# EasyEDA Pro project Rainbow.eprj

# Schematic Schematic1
Board Name: Board1; Create Date: 2022-11-18; Page Name: P1; Project Name: Rainbow; Schematic Name: Schematic1; Update Date: 2024-11-10; Company: 嘉立创EDA; Page Size: A4; Version: V1.0
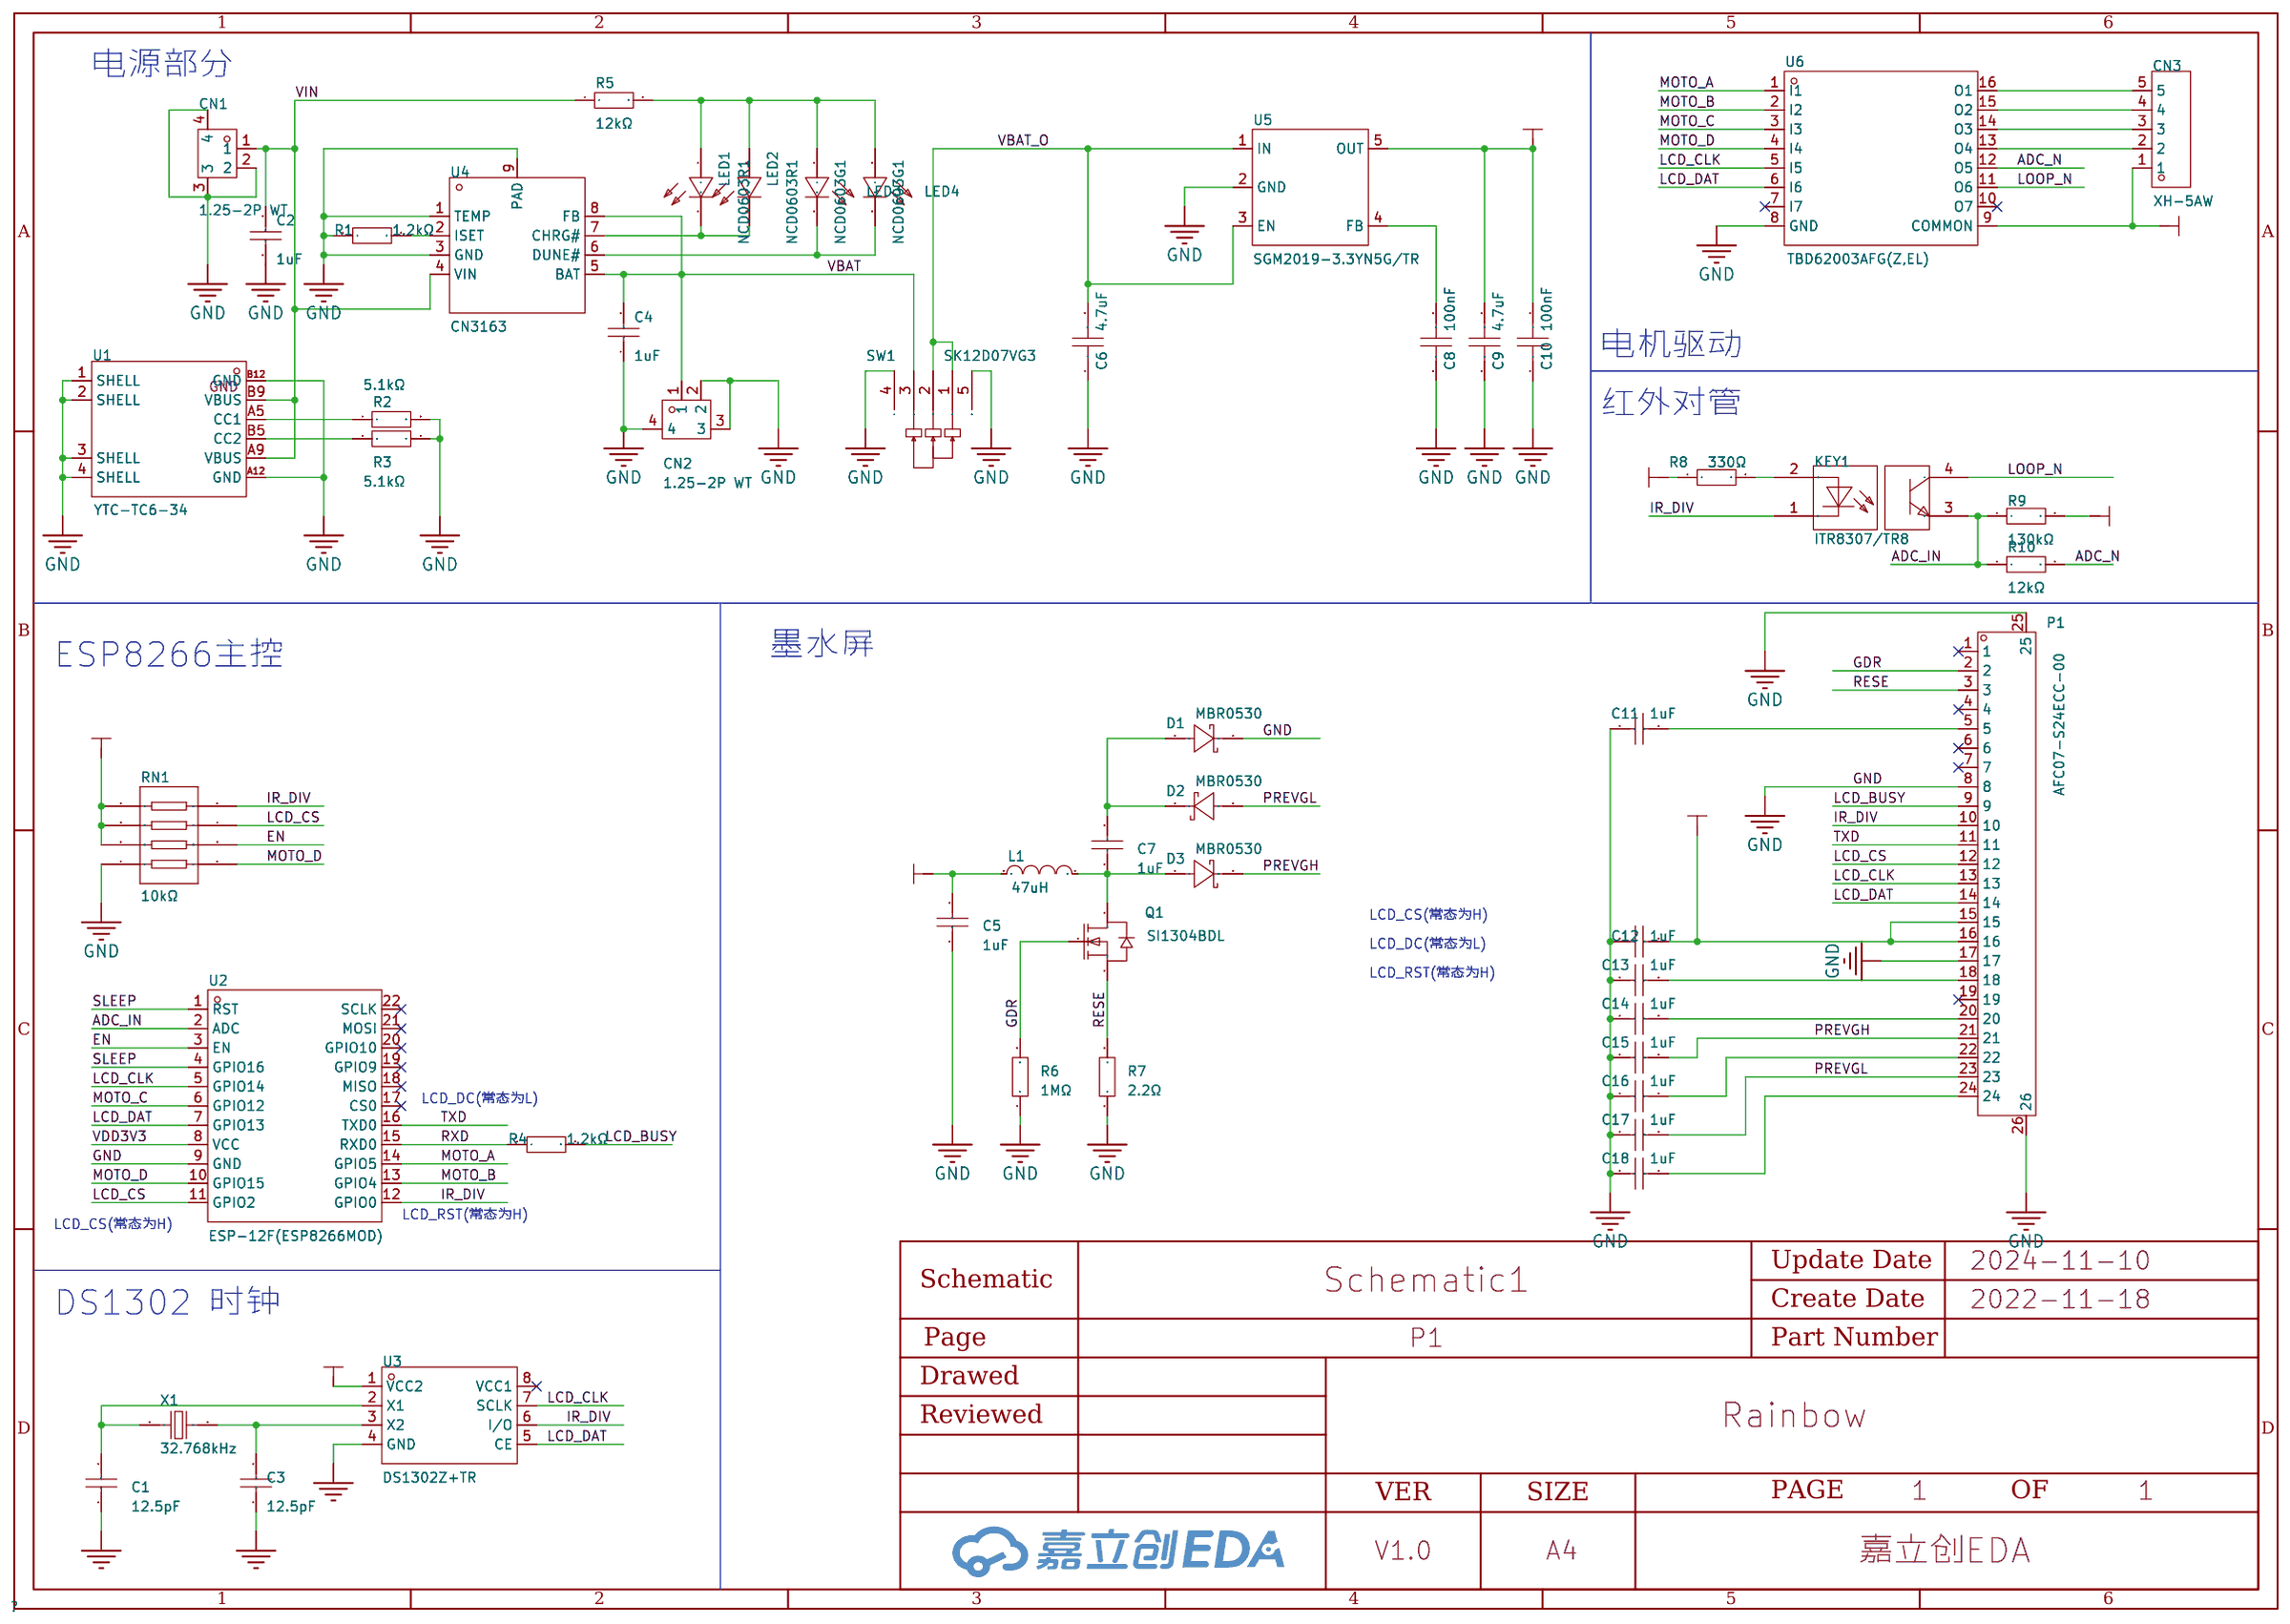
[diagram p0: schematic sheet]

## Parts
C1  12.5pF  [C0603]
C2  1uF  [C0603]
C3  12.5pF  [C0603]
C4  1uF  [C0603]
C5  1uF  [C0603]
C6  4.7uF  [C0603]
C7  1uF  [C0603]
C8  100nF  [C0603]
C9  4.7uF  [C0603]
C10  100nF  [C0603]
C11  1uF  [C0603]
C12  1uF  [C0603]
C13  1uF  [C0603]
C14  1uF  [C0603]
C15  1uF  [C0603]
C16  1uF  [C0603]
C17  1uF  [C0603]
C18  1uF  [C0603]
CN1  1.25-2P WT  [CONN-SMD_1.25-2PWT]
CN2  1.25-2P WT  [CONN-SMD_1.25-2PWT]
CN3  XH-5AW  [CONN-TH_5P-P2.54_XH-5AW_C2908614]
D1  MBR0530  [SOD-123_L2.7-W1.6-LS3.7-RD-1]
D2  MBR0530  [SOD-123_L2.7-W1.6-LS3.7-RD-1]
D3  MBR0530  [SOD-123_L2.7-W1.6-LS3.7-RD-1]
KEY1  ITR8307/TR8  [OPTO-4P-L3.4-W2.7-P1.30-LS4.6]
L1  47uH  [IND-SMD_L5.0-W5.0_MPIT50X0]
LED1  NCD0603R1  [LED0603-RD_RED]
LED2  NCD0603R1  [LED0603-RD_RED]
LED3  NCD0603G1  [LED0603-RD]
LED4  NCD0603G1  [LED0603-RD]
P1  AFC07-S24ECC-00  [FPC-SMD_24P-L17.5-W5.4-P0.50]
Q1  SI1304BDL  [SC-70-3_L2.1-W1.3-P1.30-LS2.1-TL]
R1  1.2kΩ  [R0603]
R2  5.1kΩ  [R0603]
R3  5.1kΩ  [R0603]
R4  1.2kΩ  [R0603]
R5  12kΩ  [R0603]
R6  1MΩ  [R0603]
R7  2.2Ω  [R0603]
R8  330Ω  [R0603]
R9  130kΩ  [R0603]
R10  12kΩ  [R0603]
RN1  10kΩ  [RES-ARRAY-SMD_0603-8P-L3.2-W1.6-BL]
SW1  SK12D07VG3  [SW-TH_SK12D07VG3]
U1  YTC-TC6-34  [USB-C-SMD_YIYUAN_YTC-TC6-33]
U2  ESP-12F(ESP8266MOD)  [WIFIM-SMD_ESP-12F-ESP8266MOD]
U3  DS1302Z+TR  [SOIC-8_L4.9-W3.9-P1.27-LS6.0-BL]
U4  CN3163  [ESOP-8_L4.9-W3.9-P1.27-LS6.0-BL-EP]
U5  SGM2019-3.3YN5G/TR  [SOT-23-5_L3.0-W1.7-P0.95-LS2.8-BR]
U6  TBD62003AFG(Z,EL)  [SOIC-16_L10.8-W4.5-P1.27-LS6.8-BL]
X1  32.768kHz  [CRYSTAL-SMD_L7.0-W3.2-LS7.5]

## Library data of the parts
C1 C3 = CC0603JRNPO9BN200: 容值:20pF;精度:±5%;额定电压:50V;材质(温度系数):NP0;; LCSC Part Name: 20pF ±5% 50V; Supplier Part: C105621; Manufacturer: YAGEO(国巨); Supplier Footprint: 0603; JLCPCB Part Class: Extended Part; Datasheet: https://atta.szlcsc.com/upload/public/pdf/source/20170425/1493115771885.pdf; Supplier: LCSC; Tolerance: ±5%; Voltage Rated: 50V; Temperature Coefficient: NP0
C2 C4 C5 C7 C11-C18 = CL10A105KB8NNNC: 温度系数:X5R;精度:±10%;额定电压:50V;容值:1uF;; LCSC Part Name: 1uF(105) ±10% 50V; Supplier Part: C15849; Manufacturer: SAMSUNG(三星); Supplier Footprint: 0603; JLCPCB Part Class: Basic Part; Datasheet: https://atta.szlcsc.com/upload/public/pdf/source/20160103/1457707679084.pdf; Supplier: LCSC; Temperature Coefficient: X5R; Tolerance: ±10%; Voltage Rated: 50V
C6 C9 = CL10A106KP8NNNC: 容值:10uF;精度:±10%;额定电压:10V;材质(温度系数):X5R;; LCSC Part Name: 10uF ±10% 10V; Supplier Part: C19702; Manufacturer: SAMSUNG(三星); Supplier Footprint: 0603; JLCPCB Part Class: Basic Part; Datasheet: https://atta.szlcsc.com/upload/public/pdf/source/20160103/1457707703378.pdf; Supplier: LCSC; Tolerance: ±10%; Voltage Rated: 10V; Temperature Coefficient: X5R
C8 C10 = CC0603KRX7R9BB104: 容值:100nF;精度:±10%;额定电压:50V;材质(温度系数):X7R;; LCSC Part Name: 100nF ±10% 50V; Supplier Part: C14663; Manufacturer: YAGEO(国巨); Supplier Footprint: 0603; JLCPCB Part Class: Basic Part; Datasheet: https://atta.szlcsc.com/upload/public/pdf/source/20170116/1484561234239.pdf; Supplier: LCSC; Tolerance: ±10%; Voltage Rated: 50V; Temperature Coefficient: X7R
CN1 CN2 = 1.25-2P WT: 参考系列:-;间距:1.25mm;插针结构:1x2P;排数:1;每排PIN数:2;行距:-;公母:公型插针;安装方式:卧贴;额定电流:1A;工作温度范围:-25~+85;; LCSC Part Name: 1.25卧贴针座 1.25mm间距2P卧式贴片 WT指的是卧贴; Supplier Part: C668614; Manufacturer: SHOU HAN(首韩); Supplier Footprint: SMD,P=1.25mm; JLCPCB Part Class: Extended Part; Datasheet: https://atta.szlcsc.com/upload/public/pdf/source/20200618/C668614_A66416DD0743C4A51377B45DB73E146E.pdf; Supplier: LCSC; Pitch: 1.25mm; Pins Structure: 1x2P; Number of Rows: 1; Number of PINs Per Row: 2; Gender: 公型插针; Mounting Style: 卧贴; Current Rating (Max): 1A; Operating Temperature Range: -25~+85
CN3 = XH-5AW: 参考系列:XH;间距:2.54mm;插针结构:1x5P;排数:1;每排PIN数:5;行距:-;公母:公型插针;安装方式:弯插;额定电流:3A;工作温度范围:-25~+85;; LCSC Part Name: 5P 2.54mm; Supplier Part: C2908614; Manufacturer: HCTL(华灿天禄); Supplier Footprint: 插件,P=2.54mm; JLCPCB Part Class: Extended Part; Datasheet: https://atta.szlcsc.com/upload/public/pdf/source/20211021/ACA2D54D99493880102FCACAC8DAABA8.pdf; Supplier: LCSC; Reference Series: XH; Pitch: 2.54mm; Pins Structure: 1x5P; Number of Rows: 1; Number of PINs Per Row: 5; Gender: 公型插针; Mounting Style: 弯插; Current Rating (Max): 3A; Operating Temperature Range: -25~+85
D1-D3 = MBR0530_C699108: 直流反向耐压(Vr):30V;平均整流电流(Io):500mA;正向压降(Vf):550mV@500mA;; LCSC Part Name: 30V 500mA 550mV@500mA; Supplier Part: C699108; Manufacturer: YANGJIE(扬杰); Supplier Footprint: SOD-123; JLCPCB Part Class: Extended Part; Datasheet: https://atta.szlcsc.com/upload/public/pdf/source/20200709/C699108_94C8F1A54679DD603C9696C8694A3BC2.pdf; Supplier: LCSC; Reverse Voltage (Vr): 30V; Average Rectified Current (Io): 500mA; Forward Voltage (Vf@If): 550mV@500mA
KEY1 = ITR8307/TR8: Supplier Part: C67922; Manufacturer: EVERLIGHT(台湾亿光); Supplier Footprint: SMD; JLCPCB Part Class: Extended Part; Datasheet: https://atta.szlcsc.com/upload/public/pdf/source/20171026/C67922_15089856553751059593.pdf; Supplier: LCSC
L1 = MPIT5020-470M-LF: 电感值:47uH;精度:±20%;额定电流:-;直流电阻(DCR):-;; LCSC Part Name: 47uH ±20%; Supplier Part: C696476; Manufacturer: microgate(麦捷科技); Supplier Footprint: SMD; JLCPCB Part Class: Extended Part; Datasheet: https://atta.szlcsc.com/upload/public/pdf/source/20200707/C696475_E9BDF73C854779A782235EC557F5C3FA.pdf; Supplier: LCSC; Tolerance: ±20%
LED1 LED2 = NCD0603R1_C84263: 发光颜色:红灯;; LCSC Part Name: 红灯; Supplier Part: C84263; Manufacturer: 国星光电; Supplier Footprint: 0603; JLCPCB Part Class: Extended Part; Datasheet: https://atta.szlcsc.com/upload/public/pdf/source/20200820/C84263_DABC6A75E58F576973B407FDBA283D60.pdf; Supplier: LCSC; Emitted Color: 红灯
LED3 LED4 = NCD0603G1: 发光颜色:翠绿;; LCSC Part Name: 翠绿; Supplier Part: C84267; Manufacturer: 国星光电; Supplier Footprint: 0603; JLCPCB Part Class: Extended Part; Datasheet: https://atta.szlcsc.com/upload/public/pdf/source/20200820/C84267_04BA7703640BAC111D09F5EFB971FBF3.pdf; Supplier: LCSC; Emitted Color: 翠绿
P1 = AFC07-S24ECC-00: 间距:0.5mm;触点数量:24;锁定特性:抽屉式;安装类型:卧贴;触点类型:上接;; LCSC Part Name: 0.5mm P数:24 抽屉式 上接; Supplier Part: C11092; Manufacturer: JS(钜硕电子); Supplier Footprint: SMD,P=0.5mm; JLCPCB Part Class: Extended Part; Datasheet: https://atta.szlcsc.com/upload/public/pdf/source/20151024/1457707484416.pdf; Supplier: LCSC; Pitch: 0.5mm; Number of Contacts: 24; Locking Feature: 抽屉式; Mounting Type: 卧贴; Contact Type: 上接; Height Above Board: 2mm; FFC, FCB Thickness: 0.3mm
Q1 = SI1304BDL: 类型:N沟道;漏源电压(Vdss):20V;连续漏极电流(Id):4A;功率(Pd):-;导通电阻(RDS(on)@Vgs,Id):36mΩ@10V,4A;阈值电压(Vgs(th)@Id):-;栅极电荷(Qg@Vgs):-;输入电容(Ciss@Vds):-;反向传输电容(Crss@Vds):-;; LCSC Part Name: N沟道 20V 4A; Supplier Part: C710060; Manufacturer: VBsemi(微碧); Supplier Footprint: SC-70-3; JLCPCB Part Class: Extended Part; Datasheet: https://atta.szlcsc.com/upload/public/pdf/source/20200723/C710060_EBAE81AD5E022006CACE43A153102A3D.pdf; Supplier: LCSC; Type: N沟道; Drain Source Voltage (Vdss): 20V; Continuous Drain Current (Id): 4A; Drain Source On Resistance (RDS(on)@Vgs,Id): 36mΩ@10V,4A
R1 R4 = RC0603FR-071K2L: 电阻类型:厚膜电阻;阻值:1.2kΩ;精度:±1%;功率:100mW;温度系数:±100ppm/;最大工作电压:75V;工作温度范围:-55~+155;; LCSC Part Name: 1.2kΩ ±1% 100mW; Supplier Part: C114605; Manufacturer: YAGEO(国巨); Supplier Footprint: 0603; JLCPCB Part Class: Extended Part; Datasheet: https://atta.szlcsc.com/upload/public/pdf/source/20170912/C114605_1505207784050963429.pdf; Supplier: LCSC; Type: 厚膜电阻; Tolerance: ±1%; Power(Watts): 100mW; Temperature Coefficient: ±100ppm/; Overload Voltage (Max): 75V; Operating Temperature Range: -55~+155
R2 R3 R5 R10 = RC0603FR-0712KL: 电阻类型:厚膜电阻;阻值:12kΩ;精度:±1%;功率:100mW;温度系数:±100ppm/;最大工作电压:75V;工作温度范围:-55~+155;; LCSC Part Name: 12kΩ ±1%; Supplier Part: C114659; Manufacturer: YAGEO(国巨); Supplier Footprint: 0603; JLCPCB Part Class: Extended Part; Datasheet: https://atta.szlcsc.com/upload/public/pdf/source/20170818/C114659_1503051151743895126.pdf; Supplier: LCSC; Type: 厚膜电阻; Tolerance: ±1%; Power(Watts): 100mW; Temperature Coefficient: ±100ppm/; Overload Voltage (Max): 75V; Operating Temperature Range: -55~+155
R6 = RC0603FR-071ML: 电阻类型:厚膜电阻;阻值:1MΩ;精度:±1%;功率:100mW;温度系数:±100ppm/;最大工作电压:75V;工作温度范围:-55~+155;; LCSC Part Name: 1MΩ ±1% 100mW; Supplier Part: C105578; Manufacturer: YAGEO(国巨); Supplier Footprint: 0603; JLCPCB Part Class: Extended Part; Datasheet: https://atta.szlcsc.com/upload/public/pdf/source/20181102/C105578_67A9388250AF143DE4682E62257D2969.pdf; Supplier: LCSC; Type: 厚膜电阻; Tolerance: ±1%; Power(Watts): 100mW; Temperature Coefficient: ±100ppm/; Overload Voltage (Max): 75V; Operating Temperature Range: -55~+155
R7 = RC0603FR-072R2L: 电阻类型:厚膜电阻;阻值:2.2Ω;精度:±1%;功率:100mW;温度系数:±200ppm/;最大工作电压:75V;工作温度范围:-55~+155;; LCSC Part Name: 2.2Ω ±1% 100mW; Supplier Part: C112307; Manufacturer: YAGEO(国巨); Supplier Footprint: 0603; JLCPCB Part Class: Extended Part; Datasheet: https://atta.szlcsc.com/upload/public/pdf/source/20170912/C112307_1505207748319963378.pdf; Supplier: LCSC; Type: 厚膜电阻; Tolerance: ±1%; Power(Watts): 100mW; Temperature Coefficient: ±200ppm/; Overload Voltage (Max): 75V; Operating Temperature Range: -55~+155
R8 = RC0603FR-07330RL: 电阻类型:厚膜电阻;阻值:330Ω;精度:±1%;功率:100mW;温度系数:±100ppm/;最大工作电压:75V;工作温度范围:-55~+155;; LCSC Part Name: 330Ω ±1% 100mW; Supplier Part: C105881; Manufacturer: YAGEO(国巨); Supplier Footprint: 0603; JLCPCB Part Class: Extended Part; Datasheet: https://atta.szlcsc.com/upload/public/pdf/source/20170818/C105881_1503051103301895052.pdf; Supplier: LCSC; Type: 厚膜电阻; Tolerance: ±1%; Power(Watts): 100mW; Temperature Coefficient: ±100ppm/; Overload Voltage (Max): 75V; Operating Temperature Range: -55~+155
R9 = RC0603FR-07130KL: 电阻类型:厚膜电阻;阻值:130kΩ;精度:±1%;功率:100mW;; LCSC Part Name: 130kΩ ±1% 100mW; Supplier Part: C163432; Manufacturer: YAGEO(国巨); Supplier Footprint: 0603; JLCPCB Part Class: Extended Part; Datasheet: https://atta.szlcsc.com/upload/public/pdf/source/20180111/C163432_15156544276051258953.pdf; Supplier: LCSC; Type: 厚膜电阻; Tolerance: ±1%; Power(Watts): 100mW; Temperature Coefficient: ±100ppm/℃; Overload Voltage (Max): 75V; Operating Temperature Range: -55℃~+155℃
RN1 = 4D03WGJ0103T5E: 阻值:10kΩ;单个元件功率:62.5mW;电阻器数:4;引脚数:8;; LCSC Part Name: 10kΩ ±5%; Supplier Part: C29718; Manufacturer: UNI-ROYAL(厚声); Supplier Footprint: 0603x4; JLCPCB Part Class: Basic Part; Datasheet: https://atta.szlcsc.com/upload/public/pdf/source/20170615/1497511005633.pdf; Supplier: LCSC; Power(Watts): 62.5mW; Number of Resistors: 4; Number of Pins: 8
SW1 = SK12D07VG3: LCSC Part Name: 两档位卧式拨动开关,柄长3MM; Supplier Part: C431547; Manufacturer: SHOU HAN(首韩); Supplier Footprint: 插件; JLCPCB Part Class: Extended Part; Datasheet: https://atta.szlcsc.com/upload/public/pdf/source/20190925/C431547_01B93C6F3FA5C09E15F8CCBF4E6DB91A.pdf; Supplier: LCSC
U1 = YTC-TC6-34: 连接器类型:Type-C;标准:-;公母:母座;触点数量:6;端口数量:1;安装方式:沉板;额定电流 - 电源:5A;工作温度范围:-20℃~+85℃;; LCSC Part Name: Type-C 母座 沉板; Supplier Part: C2927284; Manufacturer: YIYUAN(怡远); Supplier Footprint: SMD; JLCPCB Part Class: Extended Part; Datasheet: https://atta.szlcsc.com/upload/public/pdf/source/20211202/C52547D62212D3B747C05A2501E14934.pdf; Supplier: LCSC; Connector Type: Type-C; Gender: 母座; Number of Contacts: 6; Number of Ports: 1; Mounting Style: 沉板; Current Rating - Power (Max): 5A; Operating Temperature Range: -20℃~+85℃; NO_CONNECT: yes; NAME: GND
U2 = ESP-12F(ESP8266MOD): 屏蔽罩上的丝印是：ESP8266MOD，ESP8266EX串口WIFI; Supplier Part: C82891; Manufacturer: Ai-Thinker(安信可); Supplier Footprint: WIFI模块; JLCPCB Part Class: Extended Part; Datasheet: https://atta.szlcsc.com/upload/public/pdf/source/20181205/C82891_2E0132AC394619135072CDB340405D53.pdf; Supplier: LCSC
U3 = DS1302Z+T&R: 接口:SPI;; Supplier Part: C8959; Manufacturer: ADI(亚德诺)/MAXIM(美信); Supplier Footprint: SOIC-8; JLCPCB Part Class: 扩展库; Datasheet: https://atta.szlcsc.com/upload/public/pdf/source/20120901/1457706533203.pdf; Supplier: LCSC; Interface: SPI; Operating Voltage: 2V~5.5V
U4 = CN3163: 充电电池的类型:-;电池单元组数:-;最大充电电流:-;充满的电池组电压:-;最大供应电压:-;; Supplier Part: C559031; Manufacturer: CONSONANCE(上海如韵); Supplier Footprint: ESOP-8; JLCPCB Part Class: Extended Part; Datasheet: https://atta.szlcsc.com/upload/public/pdf/source/20200525/C559031_07C3DFF767A107D34DBB0F6756A9105C.pdf; Supplier: LCSC
U5 = SGM2019-3.3YN5G/TR: 输出类型:固定;输出极性:正;输出通道数:1;最大输入电压:5.5V;输出电压:3.3V;压差:400mV@(300mA);输出电流:300mA;电源纹波抑制比(PSRR):74dB@(1kHz);; LCSC Part Name: 正 Vin=5.5V Vout=3.3V 300mA 74dB@(1kHz); Supplier Part: C23613; Manufacturer: SGMICRO(圣邦微); Supplier Footprint: SOT-23-5; JLCPCB Part Class: Extended Part; Datasheet: https://atta.szlcsc.com/upload/public/pdf/source/20140228/1457706997483.pdf; Supplier: LCSC; Output Type: 固定; Output Polarity: 正; Number of Outputs: 1; Maximum Input Voltage: 5.5V; Output Voltage: 3.3V; Dropout Voltage: 400mV@(300mA); Output Current: 300mA; Power Supply Rejection Ratio (PSRR): 74dB@(1kHz)
U6 = TBD62003AFG(Z,EL): 新产品，本芯片用场效应管作输出管，相比传统的ULN2003（三极管做输出管）管压降更低，芯片发热更少，驱动性能更佳。; Supplier Part: C163227; Manufacturer: TOSHIBA(东芝); Supplier Footprint: SOIC-16; JLCPCB Part Class: Extended Part; Datasheet: https://atta.szlcsc.com/upload/public/pdf/source/20180126/C163227_15169515295441308285.pdf; Supplier: LCSC
X1 = HY32768KSMD3068YA2R30: 频率:32.768kHz;常温频差:±20ppm;外接负载电容:12.5pF;频率稳定度(全温):±10ppm;; LCSC Part Name: 32.768kHz ±20ppm 12.5pF; Supplier Part: C5265854; Manufacturer: Huiyuan crystal(惠源晶工); Supplier Footprint: HC-49S-SMD-Mini; JLCPCB Part Class: 扩展库; Datasheet: https://atta.szlcsc.com/upload/public/pdf/source/20221116/C6A24499FD916DB4626B9C4DB8881109.pdf; Supplier: LCSC; Normal temperature Frequency Tolerance: ±20ppm; External load capacitor: 12.5pF; Frequency Stability(Full temperature range): ±10ppm; Equivalent Series Resistance (ESR): 70kΩ; Operating Temperature: -20℃~+70℃

## Nets
GND: C1.1 C2.1 C3.1 C4.1 C5.1 C6.1 C8.1 C9.1 C10.1 C11.1 C12.1 C13.1 C14.1 C15.1 C16.1 C17.1 C18.1 CN1.2 CN1.3 CN1.4 CN2.2 CN2.3 CN2.4 D1.1(K) P1.8 P1.17 P1.25 P1.26 R1.1 R2.2 R3.2 R6.1 R7.1 RN1.4 SW1.4 SW1.5 U1.1(SHELL) U1.2(SHELL) U1.3(SHELL) U1.4(SHELL) U1.A12(GND) U1.B12(GND) U2.9(GND) U3.4(GND) U4.1(TEMP) U4.3(GND) U4.9(PAD) U5.2(GND) U6.8(GND)
VBAT: C4.2 CN2.1 SW1.3 U4.5(BAT) U4.8(FB)
VBAT_O: C6.2 CN3.1 R9.2 SW1.1 SW1.2 U5.1(IN) U5.3(EN) U6.9(COMMON)
VDD3V3: C5.2 C9.2 C10.2 C12.2 L1.1 P1.15 P1.16 R8.1 RN1.1 RN1.2 RN1.3 U2.8(VCC) U3.1(VCC2) U5.5(OUT)
VIN: C2.2 CN1.1 R5.1 U1.A9(VBUS) U1.B9(VBUS) U4.4(VIN)
ADC_IN: KEY1.3 R9.1 R10.1 U2.2(ADC)
ADC_N: R10.2 U6.12(O5)
EN: RN1.6 U2.3(EN)
GDR: P1.2 Q1.1(G) R6.2
IR_DIV: KEY1.1 P1.10 RN1.8 U2.12(GPIO0) U3.6(I/O)
LCD_BUSY: P1.9 R4.2
LCD_CLK: P1.13 U2.5(GPIO14) U3.7(SCLK) U6.5(I5)
LCD_CS: P1.12 RN1.7 U2.11(GPIO2)
LCD_DAT: P1.14 U2.7(GPIO13) U3.5(CE) U6.6(I6)
LOOP_N: KEY1.4 U6.11(O6)
MOTO_A: U2.14(GPIO5) U6.1(I1)
MOTO_B: U2.13(GPIO4) U6.2(I2)
MOTO_C: U2.6(GPIO12) U6.3(I3)
MOTO_D: RN1.5 U2.10(GPIO15) U6.4(I4)
PREVGH: C15.2 D3.1(K) P1.21
PREVGL: C17.2 D2.2(A) P1.23
RESE: P1.3 Q1.2(S) R7.2
RXD: R4.1 U2.15(RXD0)
SLEEP: U2.1(RST) U2.4(GPIO16)
TXD: P1.11 U2.16(TXD0)
$1N3873: C8.2 U5.4(FB)
$1N4113: LED1.1(K) LED2.1(K) U4.7(CHRG#)
$1N4121: LED3.1(K) LED4.1(K) U4.6(DUNE#)
$1N5064: LED1.2(A) LED2.2(A) LED3.2(A) LED4.2(A) R5.2
$1N5356: R1.2 U4.2(ISET)
$1N10896: KEY1.2 R8.2
$1N16714: C14.2 P1.20
$1N16794: C16.2 P1.22
$1N16876: C18.2 P1.24
$1N17283: C13.2 P1.18
$1N19263: C11.2 P1.5
$1N20556: C7.2 D1.2(A) D2.1(K)
$1N20618: C7.1 D3.2(A) L1.2 Q1.3(D)
$1N39288: CN3.5 U6.16(O1)
$1N39568: CN3.4 U6.15(O2)
$1N39637: CN3.3 U6.14(O3)
$1N39740: CN3.2 U6.13(O4)
$1N63361: R3.1 U1.B5(CC2)
$1N63365: R2.1 U1.A5(CC1)
$1N63715: C1.2 U3.2(X1) X1.1
$1N63722: C3.2 U3.3(X2) X1.2

Not connected (* = marked no-connect by the designer): P1 1* 4* 6* 7* 19*; U2 17(CS0)* 18(MISO)* 19(GPIO9)* 20(GPIO10)* 21(MOSI)* 22(SCLK)*; U3 8(VCC1)*; U6 7(I7)* 10(O7)*

## Notes on the sheet
- 电源部分
- 电机驱动
- 红外对管
- 墨水屏
- ESP8266主控
- LCD_CS(常态为H)
- LCD_DC(常态为L)
- LCD_RST(常态为H)
- LCD_DC(常态为L)
- LCD_CS(常态为H)
- LCD_RST(常态为H)
- DS1302 时钟

# Board PCB1
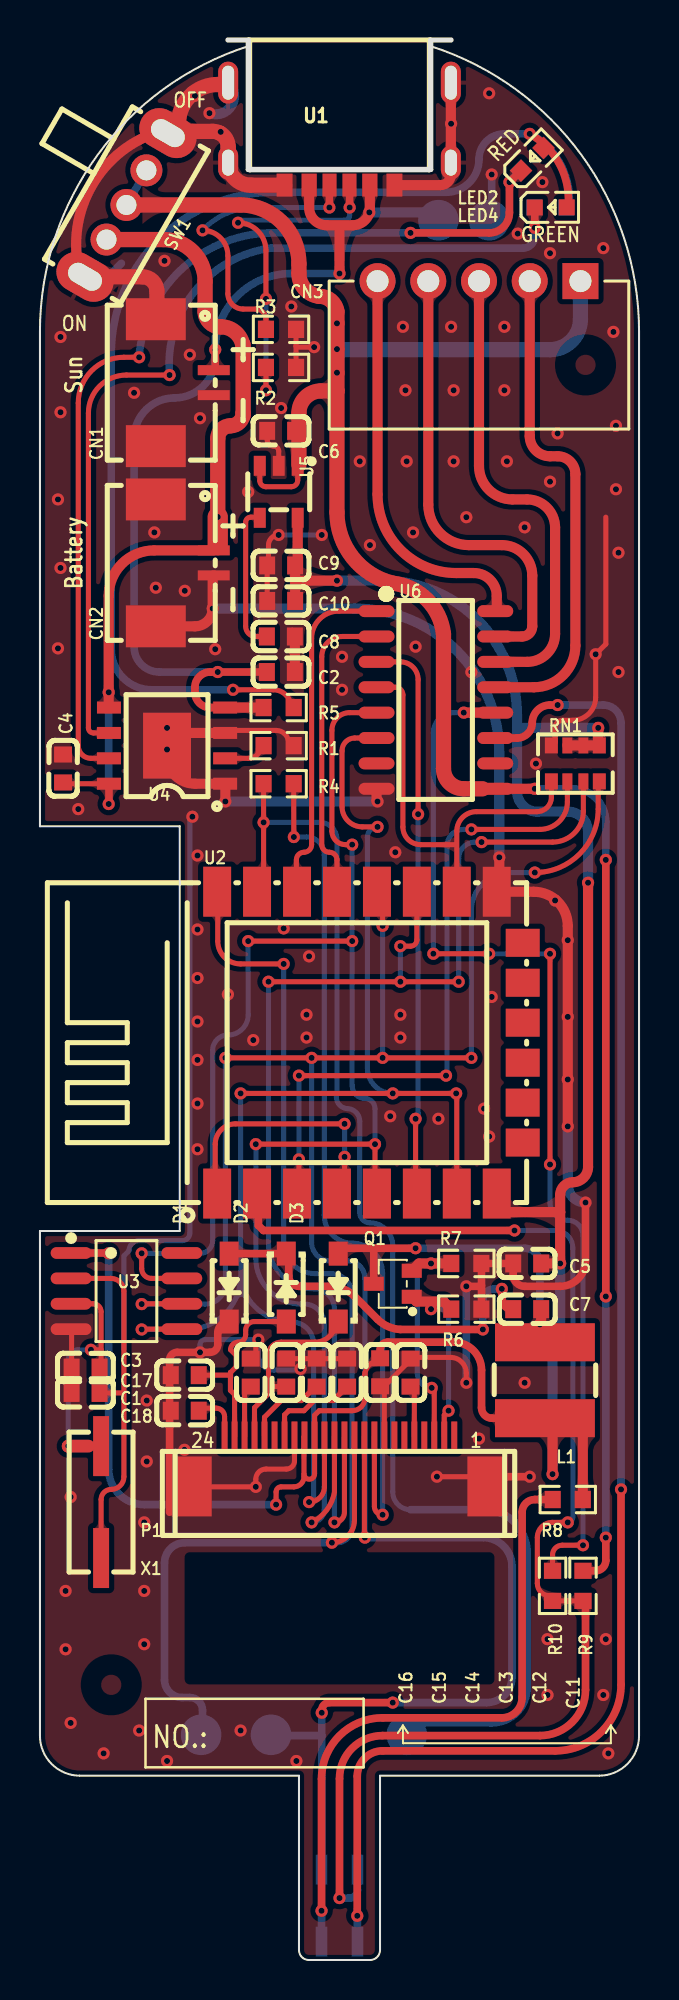
[diagram p1: board, top side]
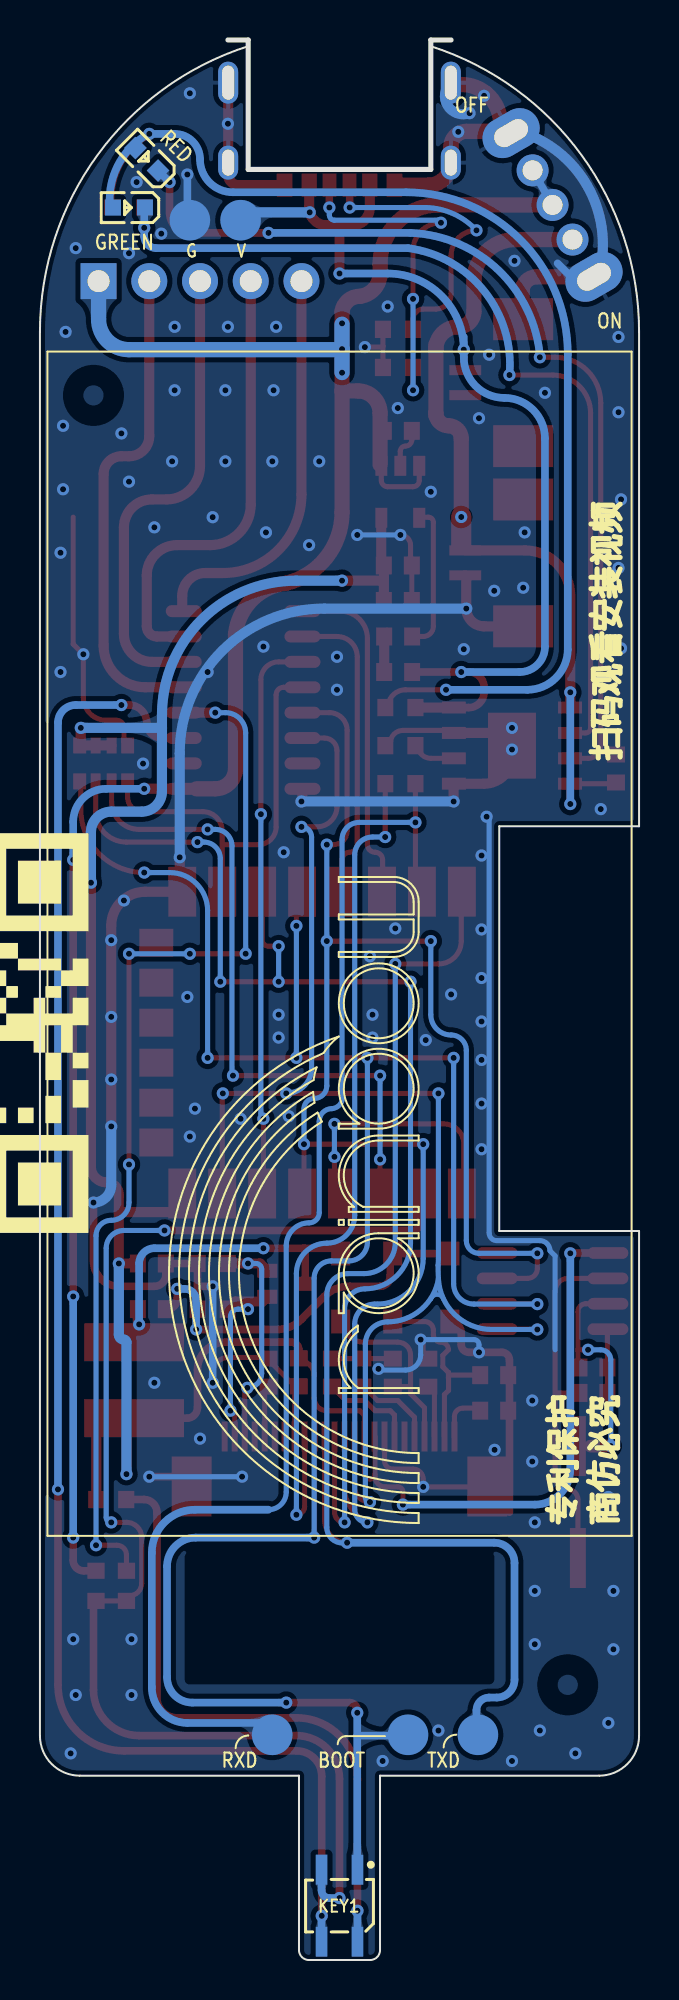
[diagram p2: board, bottom side, seen from below]

Outline 30 x 96.06 mm; copper layers: Top Layer, Bottom Layer. Coordinates in mm from the lower left corner of the outline.
Outline path: 19.57,95.75 arc(27.12,90.31) 30,81.47 30,11.22 arc(29.41,9.81) 28,9.22 17.03,9.22 17.03,0.5 arc(16.88,0.15) 16.53,0 13.47,0 arc(13.12,0.15) 12.97,0.5 12.97,9.22 2,9.22 arc(0.59,9.81) 0,11.22 0,36.47 7,36.47 7,56.72 0,56.72 0,81.47 arc(2.88,90.31) 10.43,95.75 10.43,89.61 19.57,89.61
Stack: Top Layer 0.035mm / Dielectric1 1.51mm FR4 er 4.5 / Bottom Layer 0.035mm

## Design rules (mm)
template: 用户自定义配置
spacing safeClearance (default): track to track 0.152, other pairs 0.152 to 0.3
track width trackWidth (default): min 0.127, default 0.254, max 2.54
differential pair differentialPair (default): width min 0.127, default 0.254, max 2.54; gap min 0.152, default 0.152
via viaSize (default): diameter min 0.5, default 0.61, max 10; hole min 0.3, default 0.305, max 6

## Placement (name value [footprint] x y rotation side)
C1  12.5pF  [C0603]  2.29 28.37 0 top
C2  1uF  [C0603]  12.06 64.44 180 top
C3  12.5pF  [C0603]  2.29 29.64 0 top
C4  1uF  [C0603]  1.16 59.62 270 top
C5  1uF  [C0603]  24.4 34.85 0 top
C6  4.7uF  [C0603]  12.08 76.51 0 top
C7  1uF  [C0603]  24.4 32.56 180 top
C8  100nF  [C0603]  12.06 66.22 180 top
C9  4.7uF  [C0603]  12.08 69.78 0 top
C10  100nF  [C0603]  12.08 68 0 top
C11  1uF  [C0603]  18.56 29.39 270 top
C12  1uF  [C0603]  17.04 29.4 90 top
C13  1uF  [C0603]  15.38 29.39 270 top
C14  1uF  [C0603]  13.86 29.39 270 top
C15  1uF  [C0603]  12.33 29.39 270 top
C16  1uF  [C0603]  10.56 29.39 270 top
C17  1uF  [C0603]  7.25 29.26 0 top
C18  1uF  [C0603]  7.25 27.48 0 top
CN1  1.25-2P WT  [CONN-SMD_1.25-2PWT]  7.25 78.92 90 top
CN2  1.25-2P WT  [CONN-SMD_1.25-2PWT]  7.25 69.9 90 top
CN3  XH-5AW  [CONN-TH_5P-P2.54_XH-5AW_C2908614]  21.99 84 180 top
D1  MBR0530  [SOD-123_L2.7-W1.6-LS3.7-RD-1]  9.48 33.64 90 top
D2  MBR0530  [SOD-123_L2.7-W1.6-LS3.7-RD-1]  12.33 33.64 270 top
D3  MBR0530  [SOD-123_L2.7-W1.6-LS3.7-RD-1]  14.94 33.64 90 top
KEY1  ITR8307/TR8  [OPTO-4P-L3.4-W2.7-P1.30-LS4.6]  15 2.72 90 bottom
L1  47uH  [IND-SMD_L5.0-W5.0_MPIT50X0]  25.29 29.01 90 top
LED1  NCD0603R1  [LED0603-RD_RED]  24.65 90.1 45 bottom
LED2  NCD0603R1  [LED0603-RD_RED]  24.65 90.1 45 top
LED3  NCD0603G1  [LED0603-RD]  25.54 87.68 0 bottom
LED4  NCD0603G1  [LED0603-RD]  25.58 87.69 0 top
NOREF  -  [Pad_e3813]  19.95 87.05 0 top
NOREF#2  -  [Pad_e1130]  18.37 11.27 180 top
NOREF#3  -  [Pad_e1124]  8.07 11.27 0 top
NOREF#4  -  [Pad_e1129]  11.57 11.27 0 top
NOREF#5  -  [Pad_e3814]  22.49 87.05 0 top
P1  AFC07-S24ECC-00  [FPC-SMD_24P-L17.5-W5.4-P0.50]  15 24.94 0 top
Q1  SI1304BDL  [SC-70-3_L2.1-W1.3-P1.30-LS2.1-TL]  17.67 33.83 180 top
R1  1.2kΩ  [R0603]  11.95 60.76 180 top
R2  5.1kΩ  [R0603]  12.07 79.68 0 top
R3  5.1kΩ  [R0603]  12.07 81.59 0 top
R4  1.2kΩ  [R0603]  11.95 58.85 0 top
R5  12kΩ  [R0603]  11.95 62.66 0 top
R6  1MΩ  [R0603]  21.35 32.56 180 top
R7  2.2Ω  [R0603]  21.35 34.85 180 top
R8  330Ω  [R0603]  26.43 23.04 180 top
R9  130kΩ  [R0603]  27.19 18.72 90 top
R10  12kΩ  [R0603]  25.67 18.72 90 top
RN1  10kΩ  [RES-ARRAY-SMD_0603-8P-L3.2-W1.6-BL]  26.81 59.87 180 top
SW1  SK12D07VG3  [SW-TH_SK12D07VG3]  4.33 87.81 240 top
U1  YTC-TC6-34  [USB-C-SMD_YIYUAN_YTC-TC6-33]  15 91.37 180 top
U2  ESP-12F(ESP8266MOD)  [WIFIM-SMD_ESP-12F-ESP8266MOD]  16.52 45.9 0 top
U3  DS1302Z+TR  [SOIC-8_L4.9-W3.9-P1.27-LS6.0-BL]  4.33 33.47 270 top
U4  CN3163  [ESOP-8_L4.9-W3.9-P1.27-LS6.0-BL-EP]  6.36 60.76 90 top
U5  SGM2019-3.3YN5G/TR  [SOT-23-5_L3.0-W1.7-P0.95-LS2.8-BR]  11.96 73.46 90 top
U6  TBD62003AFG(Z,EL)  [SOIC-16_L10.8-W4.5-P1.27-LS6.8-BL]  19.83 63.04 270 top
X1  32.768kHz  [CRYSTAL-SMD_L7.0-W3.2-LS7.5]  3.06 22.91 90 top

## Footprints (pads in the part's own frame, mm; a bottom-side part is the same pattern mirrored in y, then rotated)
C0603
  rect 0.8x0.9 smd: 1(-0.7,0) 2(0.7,0)
CONN-SMD_1.25-2PWT
  rect 0.5x1.6 smd: 1(0.625,-1.45) 2(-0.625,-1.45)
  rect 2.1x2.999 smd: 3(3.175,1.45) 4(-3.175,1.45)
CONN-TH_5P-P2.54_XH-5AW_C2908614
  rect 1.801x1.801 hole 1.1: 1(-5.08,0)
  round 1.801 hole 1.1: 2(-2.54,0) 3(0,0) 4(2.54,0) 5(5.08,0)
CRYSTAL-SMD_L7.0-W3.2-LS7.5
  rect 3x0.8 smd: 1(-2.8,0) 2(2.8,0)
ESOP-8_L4.9-W3.9-P1.27-LS6.0-BL-EP
  rect 0.6x1.2 smd: 1(-1.905,-2.909) 2(-0.635,-2.909) 3(0.635,-2.909) 4(1.905,-2.909) 5(1.905,2.909) 6(0.635,2.909) 7(-0.635,2.909) 8(-1.905,2.909)
  rect 3.3x2.4 smd: 9(0,0)
FPC-SMD_24P-L17.5-W5.4-P0.50
  rect 0.299x1.501 smd: 1(5.745,1.25) 2(5.245,1.25) 3(4.745,1.25) 4(4.245,1.25) 5(3.747,1.25) 6(3.246,1.25) 7(2.745,1.25) 8(2.245,1.25) 9(1.745,1.25) 10(1.244,1.25) 11(0.747,1.25) 12(0.246,1.25) 13(-0.254,1.25) 14(-0.754,1.25) 15(-1.25,1.25) 16(-1.755,1.25) 17(-2.256,1.25) 18(-2.753,1.25) 19(-3.253,1.25) 20(-3.756,1.25) 21(-4.257,1.25) 22(-4.755,1.25) 23(-5.255,1.25) 24(-5.755,1.25)
  rect 1.999x2.999 smd: 25(-7.402,-1.25) 26(7.402,-1.25)
IND-SMD_L5.0-W5.0_MPIT50X0
  rect 1.9x5 smd: 1(-1.9,0) 2(1.9,0)
LED0603-RD
  rect 0.8x0.8 smd: 1(-0.799,-0.004) 2(0.799,0.004)
LED0603-RD_RED
  rect 0.8x0.8 smd: 1(-0.799,-0.004) 2(0.799,0.004)
OPTO-4P-L3.4-W2.7-P1.30-LS4.6
  rect 1.501x0.579 smd: 1(1.801,-0.899) 2(-1.801,-0.899) 3(1.801,0.899) 4(-1.801,0.899)
Pad_e1124
  round 2.032 smd far side: 1(0,0)
Pad_e1129
  round 2.032 smd far side: 2(0,0)
Pad_e1130
  round 2.032 smd far side: 3(0,0)
Pad_e3813
  round 2.032 smd far side: 1(0,0)
Pad_e3814
  round 2.032 smd far side: 1(0,0)
R0603
  rect 0.806x0.864 smd: 1(-0.753,0) 2(0.753,0)
RES-ARRAY-SMD_0603-8P-L3.2-W1.6-BL
  rect 0.65x0.8 smd: 1(-1.2,-0.9) 4(1.2,-0.9) 5(1.2,0.9) 8(-1.2,0.9)
  rect 0.5x0.8 smd: 2(-0.4,-0.9) 3(0.4,-0.9) 6(0.4,0.9) 7(-0.4,0.9)
SC-70-3_L2.1-W1.3-P1.30-LS2.1-TL
  rect 1.001x0.701 smd: 1(-0.95,0.65) 2(-0.95,-0.65) 3(0.95,0)
SOD-123_L2.7-W1.6-LS3.7-RD-1
  rect 1.2x0.95 smd: 1(-1.7,0) 2(1.7,0)
SOIC-8_L4.9-W3.9-P1.27-LS6.0-BL
  oval 0.588x2.045 smd: 1(-1.905,-2.772) 2(-0.635,-2.772) 3(0.635,-2.772) 4(1.905,-2.772) 5(1.905,2.772) 6(0.635,2.772) 7(-0.635,2.772) 8(-1.905,2.772)
SOIC-16_L10.8-W4.5-P1.27-LS6.8-BL
  oval 0.6x1.801 smd: 1(-4.445,-2.972) 2(-3.175,-2.972) 3(-1.905,-2.972) 4(-0.635,-2.972) 5(0.635,-2.972) 6(1.905,-2.972) 7(3.175,-2.972) 8(4.445,-2.972) 9(4.445,2.972) 10(3.175,2.972) 11(1.905,2.972) 12(0.635,2.972) 13(-0.635,2.972) 14(-1.905,2.972) 15(-3.175,2.972) 16(-4.445,2.972)
SOT-23-5_L3.0-W1.7-P0.95-LS2.8-BR
  rect 1x0.6 smd: 1(1.3,-0.95) 2(1.3,0) 3(1.3,0.95) 4(-1.3,0.95) 5(-1.3,-0.95)
SW-TH_SK12D07VG3
  oval 1.6x1.6 hole 1.001: 1(-1.999,0) 2(0,0) 3(1.999,0)
  oval 1.999x2.999 hole 1.001x1.801: 4(4.151,0) 5(-4.151,0)
USB-C-SMD_YIYUAN_YTC-TC6-33
  oval 1x1.7 hole 0.6x1.3: 1(-5.575,1.438) 2(5.575,1.438)
  oval 1x2.1 hole 0.6x1.7: 3(-5.575,-2.562) 4(5.575,-2.562)
  rect 0.7x1.15 smd: A5(-0.5,2.562) B5(0.5,2.562)
  rect 0.76x1.15 smd: A9(1.52,2.562) B9(-1.52,2.562)
  rect 0.8x1.15 smd: A12(2.75,2.562) B12(-2.75,2.562)
WIFIM-SMD_ESP-12F-ESP8266MOD
  rect 1.399x2.499 smd: 1(-7.651,-7.551) 2(-5.652,-7.551) 3(-3.65,-7.551) 4(-1.651,-7.551) 5(0.35,-7.551) 6(2.349,-7.551) 7(4.348,-7.551) 8(6.35,-7.551) 9(6.35,7.549) 10(4.348,7.551) 11(2.349,7.551) 12(0.35,7.551) 13(-1.651,7.549) 14(-3.65,7.551) 15(-5.652,7.551) 16(-7.651,7.551)
  rect 1.7x1.399 smd: 17(7.651,-4.998) 18(7.648,-3.002) 19(7.651,-1.004) 20(7.651,0.998) 21(7.651,2.997) 22(7.651,4.996)

## Nets
As in the schematic, except:
GND: C1.1 C2.1 C3.1 C4.1 C5.1 C6.1 C8.1 C9.1 C10.1 C11.1 C12.1 C13.1 C14.1 C15.1 C16.1 C17.1 C18.1 CN1.2 CN1.3 CN1.4 CN2.2 CN2.3 CN2.4 D1.1 NOREF#5.1 P1.8 P1.17 P1.25 P1.26 R1.1 R2.2 R3.2 R6.1 R7.1 RN1.4 SW1.4 SW1.5 U1.1 U1.2 U1.3 U1.4 U1.A12 U1.B12 U2.9 U3.4 U4.1 U4.3 U4.9 U5.2 U6.8
VIN: C2.2 CN1.1 NOREF.1 R5.1 U1.A9 U1.B9 U4.4
IR_DIV: KEY1.1 NOREF#4.2 P1.10 RN1.8 U2.12 U3.6
RXD: NOREF#2.3 R4.1 U2.15
TXD: NOREF#3.1 P1.11 U2.16

Pads without a net: P1 1 4 6 7 19; U2 17 18 19 20 21 22; U3 8; U6 7 10

## Via types
v1: diameter 0.61, hole 0.305, Top Layer to Bottom Layer, 220 vias

## Routing (per net, layer and track width the routed paths; a pad name or vN(x,y) marks a point on that pad's centre or on a via; arc(x,y) is an arc through that point)
GND: length 241.6
  Top Layer w0.254: 12.64,66.54 12.64,66.09 ; 17.24,28.7 17.25,28.69 17.25,26.19 ; 17.24,28.7 C12.1 ; 17.24,28.7 18.68,30.15 20.56,30.15 arc(21.12,29.92) 21.35,29.36 v1(21.35,28.88) ; C13.1 C14.1 C15.1 ; v1(10.94,31.04) 10.81,30.91 10.81,30.09 ; 12.71,60.89 R1.1 ; 9.27,61.52 11.83,61.52 arc(12.27,61.34) 12.45,60.89 ; 1.59,31.55 C3.1 C1.1 ; U5.2 11.96,75.49 arc(11.88,75.67) 11.7,75.74 arc(11.47,75.84) 11.38,76.06 C6.1 ; P1.17 12.75,24.98 arc(12.63,24.68) 12.33,24.56 11.32,24.56 arc(10.96,24.41) 10.81,24.06 v1(10.81,23.67) 7.62,23.67 P1.25 ; RN1.4 25.8,60.95 25.8,61.65 arc(25.91,61.92) 26.18,62.03 26.68,62.03 arc(27.49,62.36) 27.83,63.17 v1(27.83,65.33) 28.34,65.84 28.34,72.19 ; 21.91,24.18 v1(19.88,24.18) ; C10.1 C9.1 11.44,69.84 11.44,70.79 arc(11.59,71.15) v1(11.95,71.3) ; 12.82,80.74 R2.2 ; 12.82,80.74 R3.2 ; 12.82,80.74 arc(12.84,80.71) 12.87,80.7 v1(13.73,80.7)
  Top Layer w0.381: v1(21.35,33.71) 22.09,33.71 arc(22.11,33.71) 22.11,33.73 ; R6.1 22.11,32.57 22.11,34.84 R7.1 C5.1 23.7,34.28 arc(23.87,33.87) 24.27,33.71 26.05,33.71 arc(26.95,34.08) 27.32,34.98 v1(27.32,37.9) ; 22.76,24.18 v1(24.53,24.18) ; 6.49,22.4 6.49,30.02 arc(6.6,30.29) 6.87,30.41 v1(8.02,30.41) 8.52,30.41 arc(8.79,30.52) 8.9,30.79 8.9,31.37 arc(9.07,31.78) D1.1
  Top Layer w0.508: 2,84.34 arc(2.6,88.79) 6.15,91.53 ; U2.9 24.73,53.45 arc(25.93,52.95) 26.43,51.74 v1(26.43,51.03) v1(26.43,47.19) v1(26.43,44.06) v1(26.43,41.71) ; U2.9 22.75,53.45 ; U2.9 arc(22.96,53.49) 23,53.58 v1(23,55.17) ; C8.1 C2.1 ; 20.58,93.93 20.58,89.32 arc(20.42,88.95) 20.06,88.8 U1.B12 ; 9.28,58.85 v1(9.28,57.96) ; 16.85,58.6 16.85,58.02 v1(16.91,57.96) ; U4.3 7,61.39 U4.9 6.36,60.25 arc(6.77,59.26) 7.76,58.85 U4.1 ; CN2.4 7.76,66.73 arc(8.39,66.99) v1(8.65,67.62) 8.65,69.22 CN2.2
  Top Layer w0.762: 9.44,93.84 8.9,93.84 arc(8.24,93.72) 7.66,93.39 arc(7.13,92.72) 6.94,91.88 ; 7.47,91.49 8.65,91.49 arc(8.84,91.47) 9.02,91.4 arc(9.31,91.12) 9.43,90.72 U1.2 arc(9.75,89.13) 10.55,88.8 U1.A12 ; SW1.4 5.13,84.21 arc(5.64,84) 5.86,83.49 5.86,82.15 arc(5.84,82.11) CN1.3
  Bottom Layer w0.254: v1(14.11,71.3) v1(11.95,71.3) ; v1(8.02,30.41) 8.02,30.79 arc(8.09,30.97) 8.27,31.04 v1(10.94,31.04) 10.94,30.28 arc(11.16,29.74) 11.7,29.52 12.99,29.52 arc(13.03,29.53) v1(13.05,29.58) ; v1(19.88,24.18) v1(24.53,24.18) ; 4.21,30.53 4.21,35.23 4.46,35.49 arc(4.61,35.84) 4.97,35.99 7.13,35.99 arc(7.4,36.1) 7.51,36.37 7.51,57.08 arc(7.54,57.16) v1(7.63,57.2)
  Bottom Layer w0.381: v1(21.35,33.71) v1(21.35,28.88) ; v1(22.62,89.33) 22.62,87.17 ; SW1.4 3.4,84.21 4.08,84.89
  Bottom Layer w0.508: 2,84.34 arc(2.6,88.79) 6.15,91.53 ; v1(26.43,41.71) 26.43,38.79 arc(26.69,38.16) v1(27.32,37.9) ; v1(9.28,57.96) v1(16.91,57.96) ; v1(23,55.17) 23,60.38 arc(20.88,65.5) 15.76,67.62 v1(8.65,67.62) ; v1(8.49,92.4) arc(9.59,92.78) U1.4
  vias: v1(0.9,73.08) v1(0.9,65.63) v1(1.03,81.21) v1(1.03,77.44) v1(1.03,69.65) v1(1.28,18.47) v1(1.28,15.55) v1(1.54,23.17) v1(1.54,11.86) v1(1.92,57.58) v1(3.19,10.34) v1(4.71,78.41) v1(4.97,11.48) v1(5.22,21.9) v1(5.22,18.47) v1(5.22,15.8) v1(5.35,27.99) v1(5.35,24.94) v1(5.73,71.43) v1(5.8,68.66) v1(6.24,85.02) v1(6.36,61.65) v1(6.36,60.56) v1(6.36,9.96) v1(7.25,68.51) v1(7.24,25.53) v1(7.51,80.32) v1(7.76,93.27) v1(7.89,55.26) v1(7.89,51.56) v1(7.89,49.13) v1(7.89,46.96) v1(7.89,45.03) v1(7.89,42.85) v1(7.89,40.57) v1(8.02,77.14) v1(8.78,65.58) v1(9.05,91.47) v1(9.41,48.31) v1(10.05,11.48) v1(10.43,73.46) v1(10.68,46.03) v1(12.08,77.65) v1(12.21,51.61) v1(12.59,82.73) v1(12.84,9.96) v1(13.35,47.3) v1(13.35,46.15) v1(13.48,50.22) v1(15.13,65.2) v1(15.13,63.55) v1(16.02,74.98) v1(16.52,70.79) v1(17.54,42.22) v1(17.79,55.42) v1(18.05,47.3) v1(18.05,46.15) v1(18.18,81.71) v1(18.3,78.54) v1(18.36,74.98) v1(18.68,71.43) v1(18.81,65.71) v1(19.95,42.09) v1(20.59,91.87) v1(20.59,81.71) v1(20.72,78.54) v1(20.72,74.98) v1(21.35,72.19) v1(21.6,64.44) v1(21.99,26.09) v1(22.24,42.6) v1(22.49,93.4) v1(22.49,41.2) v1(22.62,48.19) v1(23.25,81.71) v1(23.25,78.54) v1(23.38,74.98) v1(23.92,86.37) v1(24.27,71.68) v1(24.27,28.88) v1(24.84,59.86) v1(25.16,88.95) v1(25.41,16.05) v1(25.41,13.26) v1(25.54,85.4) v1(25.54,73.97) v1(25.8,53.01) v1(25.92,76.38) v1(28.21,85.65) v1(28.21,13.26) v1(28.34,16.05) v1(28.46,10.34) v1(28.72,81.46) v1(28.84,76.76) v1(28.84,73.59) v1(28.97,70.41) v1(28.97,64.44)
VBAT: length 42.6
  Top Layer w0.254: C4.2 1.22,58.85 U4.8
  Top Layer w0.381: v1(3.44,57.84) 3.46,57.85 U4.8
  Top Layer w0.508: U4.5 3.44,62.68 v1(3.44,63.43) 3.44,68.25 arc(4.11,69.86) 5.72,70.53 CN2.1
  Top Layer w0.762: SW1.3 6.19,86.08 arc(7.66,85.47) 8.27,84 8.27,82.48 arc(8.49,81.94) 9.03,81.71 9.06,81.71 arc(9.85,81.39) 10.17,80.6 ; 10.17,80.6 10.17,80.82 ; 10.17,80.6 10.17,77.4 ; 10.17,77.27 10.17,77.4 ; 10.17,77.4 arc(9.99,76.95) 9.54,76.76 arc(9.09,76.57) 8.9,76.13 v1(8.9,72.2)
  Top Layer w1.016: v1(8.9,72.2) 8.9,70.79
  Bottom Layer w0.381: v1(3.44,63.43) v1(3.44,57.84)
VBAT_O: length 114.9
  Top Layer w0.254: U5.3 11.01,74.02 arc(11.1,73.8) 11.32,73.71 12.59,73.71 arc(12.81,73.81) 12.91,74.03 12.91,74.76
  Top Layer w0.381: v1(28.34,33.2) v1(28.34,55.04) ; R9.2 27.82,19.47 arc(28.18,19.63) 28.34,19.99 v1(28.34,21.13)
  Top Layer w0.508: v1(24.78,58.6) 22.8,58.6
  Top Layer w0.762: 14.87,78.51 v1(14.87,79.42) v1(14.87,80.6) v1(14.87,81.89) 14.87,82.48 arc(14.57,83.03) 13.98,83.24 arc(13.26,83.62) 12.97,84.38 12.97,84.87 arc(12.11,86.95) 10.03,87.81 SW1.2 ; 14.87,78.51 14.87,72.43 arc(15.66,70.17) 17.67,68.89 arc(19.38,68.06) 20.21,66.35 20.21,59.62 arc(20.5,58.9) 21.22,58.6 22.16,58.6 ; 14.87,78.51 14.08,78.51 arc(13.29,78.18) 12.97,77.4 12.97,74.82
  Bottom Layer w0.381: v1(24.78,58.6) 26.68,58.6 arc(27.85,58.12) 28.34,56.95 v1(28.34,55.04) ; SW1.1 SW1.2 ; v1(28.34,21.13) v1(28.34,33.2)
  Bottom Layer w0.762: 14.87,80.57 v1(14.87,80.6) 14.87,81.84 ; 14.87,80.57 14.87,79.43 ; 14.87,80.57 25.54,80.57 arc(26.62,81.02) 27.06,82.09 27.06,84
VDD3V3: length 126.8
  Top Layer w0.254: 13.22,24.31 arc(13.5,24.05) 13.75,24.33 P1.15 13.75,27.25 13.98,27.48 15.64,27.48 arc(16.08,27.67) 16.27,28.12 16.27,29.26 ; 16.27,29.26 16.27,29.39 ; 16.27,29.26 arc(16.48,29.77) 16.99,29.98 ; 11.83,22.91 11.83,23.42 arc(11.9,23.6) 12.08,23.67 12.71,23.67 arc(13.07,23.82) 13.22,24.18 13.22,26.17 13.25,26.19 ; 16.99,30.1 C12.2
  Top Layer w0.381: L1.1 22.64,27.11 arc(22.27,27.26) 22.11,27.63 22.11,29.52 arc(21.7,30.5) 20.72,30.91 17.41,30.91 arc(17.15,30.8) 17.04,30.54 C12.2 ; U3.1 3.43,35.37 arc(3.45,35.38) v1(3.44,35.36)
  Top Layer w0.508: 12.91,72.16 12.91,70.03 12.78,69.9 12.78,69.14 ; 12.78,69.14 12.91,69.01 v1(14.87,69.01) ; 12.78,69.14 C10.2 ; R8.1 27.18,27.61 ; RN1.3 RN1.2 RN1.1 27.95,60.83 v1(27.95,61.65) ; U2.8 22.87,37.9 23.35,37.42 26.05,37.42 ; C5.2 v1(26.05,34.85) 26.05,37.42 ; 26.05,37.42 26.05,38.28 arc(26.23,38.73) 26.68,38.91 arc(27.22,39.14) 27.45,39.68 v1(27.45,53.9) ; v1(25.67,24.31) 25.67,26.73
  Bottom Layer w0.381: v1(11.83,22.78) 5.22,22.78 arc(3.96,23.31) 3.44,24.56 v1(3.44,35.36)
  Bottom Layer w0.508: v1(27.95,61.65) 23.89,61.65 ; 23.89,61.65 23.89,58.47 arc(24.19,57.75) 24.91,57.46 26.43,57.46 arc(27.15,57.16) 27.45,56.44 v1(27.45,53.9) ; 23.89,61.65 23.89,62.28 arc(21.92,67.04) 17.16,69.01 v1(14.87,69.01) ; v1(25.67,24.31) 25.67,30.91 arc(25.71,31) 25.8,31.04 arc(25.97,31.11) 26.05,31.29 v1(26.05,34.85)
VIN: length 52.1
  Top Layer w0.381: U4.4 8.52,62.66 arc(7.98,62.89) 7.76,63.43 7.76,63.68 arc(7.98,64.22) 8.52,64.44 v1(8.9,64.44) C2.2 ; v1(8.78,80.57) 8.78,79.62 arc(8.76,79.57) CN1.1
  Top Layer w0.508: v1(15,84.38) 15,86.67 ; 11.33,62.54 R5.1 U4.4 ; U1.B9 16.52,87.66 arc(16.27,87.05) 15.66,86.79 14.37,86.79 arc(13.74,87.05) 13.48,87.68 U1.A9
  Bottom Layer w0.381: 8.78,81.21 v1(8.78,80.57) ; v1(8.78,80.57) 8.78,80.19 arc(8.18,78.75) 6.75,78.16 arc(5.31,77.56) 4.71,76.13 4.71,65.71 arc(5.08,64.81) 5.98,64.44 8.78,64.44 ; v1(8.78,80.57) arc(9.89,83.26) 12.59,84.38 v1(15,84.38)
  Bottom Layer w0.508: v1(16.49,87.44) 19.56,87.44
ADC_IN: length 66.1
  Top Layer w0.254: v1(26.43,21.9) 25.66,21.9 arc(25.13,21.68) 24.91,21.14 24.91,18.85 arc(25.09,18.4) 25.53,18.22 ; 25.53,17.97 R10.1 R9.1
  Top Layer w0.381: U2.2 10.94,38.28 10.94,36.76 11.19,36.5 v1(23.76,36.5) ; v1(15,3.1) 15,9.07 arc(15.63,10.6) 17.16,11.23 25.03,11.23 arc(26.65,11.9) 27.32,13.51 27.32,17.71 27.19,17.84
  Bottom Layer w0.254: v1(23.76,36.5) 25.8,36.5 arc(26.42,36.24) 26.68,35.61 26.68,22.15 arc(26.61,21.97) v1(26.43,21.9)
  Bottom Layer w0.381: v1(15,3.1) 15.51,3.1 arc(15.78,3.21) 15.9,3.49 KEY1.3
ADC_N: length 53.7
  Top Layer w0.254: R10.2 25.67,20.27 arc(25.81,20.61) 26.15,20.75 v1(27.19,20.75) ; v1(19.7,50.35) 22.49,50.35 arc(22.49,50.35) v1(22.49,50.34) ; v1(25.54,39.8) v1(25.54,50.34)
  Top Layer w0.508: U6.12 v1(21.22,62.41)
  Bottom Layer w0.254: v1(19.7,50.35) 19.7,61.39 arc(20,62.11) 20.72,62.41 v1(21.22,62.41) ; v1(27.19,20.75) 27.19,36.25 arc(26.97,36.79) 26.43,37.01 arc(25.8,37.27) 25.54,37.9 v1(25.54,39.8) ; v1(25.54,50.34) v1(22.49,50.34)
EN: length 32.9
  Top Layer w0.254: v1(12.97,40.06) 12.97,38.44 U2.3 ; 26.41,58.76 26.41,57.95 arc(26.01,56.97) 25.03,56.57 v1(21.6,56.57) ; v1(20.33,44.25) v1(12.97,44.25)
  Bottom Layer w0.254: v1(12.97,40.06) v1(12.97,44.25) ; v1(20.33,44.25) 20.38,44.3 20.38,55.74 arc(20.63,56.32) 21.22,56.57 v1(21.6,56.57)
GDR: length 9.4
  Top Layer w0.254: P1.2 20.25,27.27 v1(20.46,27.48)
  Top Layer w0.508: R6.2 20.22,32.95 18.86,32.95 Q1.1
  Bottom Layer w0.254: v1(19.58,32.56) 20.08,32.56 arc(20.35,32.45) 20.46,32.18 v1(20.46,27.48)
IR_DIV: length 122.2
  Top Layer w0.254: v1(16.27,21.13) 16.25,21.16 P1.10 ; v1(21.6,45.14) v1(17.16,45.14) v1(13.6,45.14) v1(9.28,45.14) ; U2.12 17.16,53.17 v1(17.16,51.74) ; U3.6 5.21,32.83 ; RN1.8 arc(27.97,58.95) 27.95,58.91 27.95,57.58 arc(27.02,55.34) v1(24.78,54.41)
  Top Layer w0.381: v1(17.67,12.88) 14.49,12.88 arc(14.22,12.77) 14.11,12.5 v1(14.11,12.37)
  Bottom Layer w0.254: v1(9.28,45.14) 9.28,33.83 arc(8.99,33.12) 8.27,32.82 v1(5.09,32.82) ; 21.6,45.26 21.6,52.5 arc(22.16,53.85) 23.51,54.41 v1(24.78,54.41) ; v1(17.16,45.14) v1(17.16,51.74) ; v1(13.6,45.14) 13.6,35.92 arc(13.88,35.25) 14.54,34.98 15.41,34.98 arc(16.02,34.72) 16.27,34.12 v1(16.27,21.13)
  Bottom Layer w0.381: 14.11,11.23 14.11,4.53 arc(14.11,4.52) KEY1.1 ; 14.11,11.23 v1(14.11,12.37) ; 14.11,11.23 11.7,11.23 ; v1(17.67,12.88) 22.37,12.88 arc(23.26,13.25) 23.64,14.15 23.64,19.7 arc(23.21,20.71) 22.2,21.13 v1(16.27,21.13)
LCD_BUSY: length 43.5
  Top Layer w0.254: P1.9 16.75,22.69 arc(16.87,22.4) v1(17.16,22.28) ; 12.71,58.73 v1(12.71,56.19)
  Bottom Layer w0.254: 12.59,56.19 13.35,56.19 arc(13.98,55.93) 14.24,55.3 14.24,37.26 arc(14.65,36.28) 15.64,35.87 arc(16.71,35.42) 17.16,34.34 v1(17.16,22.28)
LCD_CLK: length 87.5
  Top Layer w0.254: v1(15.64,55.81) 15.3,55.81 arc(14.82,56) 14.62,56.48 14.62,61.52 arc(14.88,62.15) 15.51,62.41 U6.5 ; v1(10.81,40.82) v1(16.78,40.82) 16.78,38.44 U2.5 ; v1(10.43,50.98) 15.63,50.98 arc(15.63,50.98) v1(15.64,50.98) ; U3.7 5.59,34.1 arc(5.24,34.25) 5.09,34.6 v1(5.09,35.36) ; P1.13 14.75,23.42 ; 13.6,21.89 arc(14.36,22.51) 14.75,23.41
  Bottom Layer w0.254: v1(15.64,55.81) v1(15.64,50.98) 15.64,43.74 arc(15.82,43.29) 16.27,43.11 arc(16.63,42.96) 16.78,42.6 v1(16.78,40.82) ; v1(10.43,50.98) 10.43,47.3 arc(10.13,46.58) 9.41,46.28 arc(8.87,46.06) 8.65,45.52 8.65,35.99 arc(8.46,35.54) 8.02,35.36 v1(5.09,35.36) ; v1(10.81,40.82) 10.81,35.1 arc(11.48,33.49) 13.09,32.82 13.24,32.82 arc(13.95,32.53) 14.24,31.82 14.24,22.53 arc(14.05,22.08) v1(13.6,21.9)
LCD_CS: length 63.5
  Top Layer w0.254: P1.12 15.25,22.4 arc(15.1,22.04) v1(14.75,21.9) ; RN1.7 27.21,57.48 arc(26.76,56.38) 25.67,55.93 v1(22.11,55.93) ; U2.11 18.87,51.04 arc(18.78,50.82) 18.56,50.73 v1(18.05,50.73) ; v1(20.97,48.95) v1(18.05,48.95) v1(11.44,48.95)
  Bottom Layer w0.254: v1(22.11,55.93) 21.79,55.93 arc(21.21,55.69) 20.97,55.11 v1(20.97,48.95) ; v1(11.44,48.95) 11.44,35.87 arc(12.11,34.25) 13.73,33.58 arc(14.45,33.28) 14.75,32.56 v1(14.75,21.9) ; v1(18.05,50.73) v1(18.05,48.95)
LCD_DAT: length 73
  Top Layer w0.254: U2.7 20.87,43.33 v1(20.84,43.36) v1(17.67,43.36) v1(10.05,43.36) ; v1(16.91,56.69) 16.14,56.69 arc(15.42,56.99) 15.13,57.71 15.13,60.5 arc(15.31,60.95) 15.76,61.14 U6.6 ; P1.14 14.25,23.68 arc(14.02,23.14) v1(13.48,22.91) ; U3.5 5.11,31.56 arc(5.1,31.56) v1(5.09,31.55)
  Bottom Layer w0.229: 9.79,33.07 arc(10.11,33.3) 10.43,33.07
  Bottom Layer w0.254: v1(5.09,31.55) 7.38,31.55 arc(9.22,32.28) 10.05,34.09 ; v1(10.05,43.36) 10.05,35.1 arc(10.05,34.94) 10.06,34.77 arc(10.06,34.43) 10.05,34.09 ; v1(13.48,22.91) arc(13.64,22.98) 13.7,23.14 13.7,30.81 arc(13.38,31.6) 12.59,31.93 arc(10.92,32.54) 10.05,34.09 ; v1(17.67,43.36) arc(16.77,43.73) 16.4,44.63 16.4,56.19 arc(16.55,56.55) v1(16.91,56.69)
LOOP_N: length 80
  Top Layer w0.381: v1(15.89,2.21) 15.89,9.2 arc(16.26,10.09) 17.16,10.47 25.8,10.47 arc(28.13,11.43) 29.1,13.77 v1(29.1,23.55) ; U6.11 23.89,61.14 arc(24.43,61.36) 24.65,61.9 arc(24.91,62.53) 25.54,62.79 v1(25.92,62.79)
  Bottom Layer w0.381: v1(29.1,23.55) 29.1,61.9 arc(28.84,62.53) 28.21,62.79 v1(25.92,62.79) ; v1(15.89,2.21) 15.9,2.2 KEY1.4
MOTO_A: length 17.2
  Top Layer w0.254: U6.1 14.97,67.49 arc(14,67.09) 13.6,66.13 13.6,55.81 arc(13.49,55.54) 13.22,55.42 arc(12.95,55.31) 12.84,55.04 12.84,53.48 arc(12.85,53.46) U2.14
MOTO_B: length 15.5
  Top Layer w0.254: U6.2 15.13,66.22 arc(14.41,65.92) 14.11,65.2 14.11,55.81 arc(14.22,55.54) 14.49,55.42 arc(14.76,55.31) 14.87,55.04 U2.13
MOTO_C: length 28.3
  Top Layer w0.254: v1(18.81,42.09) 18.81,38.41 U2.6 ; v1(18.94,57.33) 18.94,64.06 arc(18.68,64.69) 18.05,64.95 U6.3
  Bottom Layer w0.254: 18.81,42.22 18.94,42.34 v1(18.94,57.33)
MOTO_D: length 20.8
  Top Layer w0.254: RN1.5 25.61,58.18 arc(25.4,57.67) 24.89,57.46 21.86,57.46 arc(21.16,57.17) 20.87,56.47 U2.10 ; 16.85,63.68 17.79,63.68 arc(18.06,63.57) 18.18,63.3 18.18,56.69 arc(18.44,56.07) 19.06,55.81 20.81,55.81
PREVGH: length 9.6
  Top Layer w0.254: 11.44,28.63 11.44,30.28 arc(11.63,30.73) 12.08,30.91 13.78,30.91 arc(14.51,31.21) 14.81,31.94 ; 11.44,28.63 11.44,28.33 10.74,27.63 P1.21 ; 11.44,28.63 11.51,28.69 C15.2
PREVGL: length 9.8
  Top Layer w0.254: 9.41,29.26 C17.2 ; 9.55,29.4 9.55,29.14 9.54,29.14 ; 9.55,29.4 9.83,29.68 9.83,30.25 9.55,30.53 arc(9.66,30.8) 9.93,30.91 arc(10.19,31.02) 10.3,31.29 10.3,31.51 arc(10.43,31.82) 10.73,31.94 12.08,31.94 ; 9.55,29.4 9.54,29.39 9.54,29.14 ; 9.54,29.14 9.54,28.5 9.75,28.29 P1.23
RESE: length 11.8
  Top Layer w0.254: v1(19.62,28.63) 19.75,28.5 P1.3
  Top Layer w0.508: Q1.2 18.98,34.85 v1(19.58,34.85) R7.2
  Bottom Layer w0.254: v1(19.58,34.85) 19.19,34.85 arc(18.98,34.76) 18.9,34.56 18.9,29.35 arc(19.11,28.84) v1(19.62,28.63)
RXD: length 66.3
  Top Layer w0.254: U2.15 11.2,53.78 v1(11.2,56.92) 11.2,58.73
  Bottom Layer w0.254: v1(11.2,56.92) 14.01,56.92 arc(14.62,56.67) 14.87,56.06 14.87,43.36 arc(14.94,42.85) 15.38,42.6 arc(15.83,42.41) 16.02,41.96 16.02,37.39 arc(16.16,37.03) 16.52,36.88 arc(17.33,36.55) 17.67,35.74 17.67,23.42 arc(17.93,22.79) 18.56,22.53
  Bottom Layer w0.381: 18.56,22.53 22.24,22.53 arc(23.77,21.9) 24.4,20.37 24.4,13.64 arc(23.88,12.38) 22.62,11.86 18.97,11.86 NOREF#2.3
SLEEP: length 13.1
  Top Layer w0.254: 15.25,40.06 15.25,38.73 U2.4 ; v1(15.25,41.84) 9.79,41.84 arc(9.07,41.54) 8.78,40.82 8.78,38.44 U2.1
  Bottom Layer w0.254: v1(15.25,41.84) v1(15.25,40.18)
TXD: length 63.1
  Top Layer w0.254: P1.11 15.75,22.01 arc(15.42,21.21) v1(14.62,20.88) ; U2.16 8.9,53.42 8.9,50.98 arc(9.24,50.17) 10.05,49.84 v1(12.21,49.84)
  Bottom Layer w0.254: v1(12.21,49.84) 12.21,35.91 arc(12.66,34.8) 13.77,34.34 14.57,34.34 arc(15.32,34.03) 15.64,33.28 15.64,21.64 arc(15.37,21.06) 14.75,20.88
  Bottom Layer w0.381: v1(14.62,20.88) 7.25,20.88 arc(6.53,20.58) 6.24,19.86 6.24,14.02 arc(6.5,13.39) 7.13,13.13 7.51,13.13 arc(7.96,12.95) 8.14,12.5 8.14,11.34 arc(8.12,11.29) NOREF#3.1
$1N3873: length 7.4
  Top Layer w0.254: C8.2 10.81,66.22 arc(10.45,66.37) 10.3,66.73 10.3,71.93 arc(10.38,72.11) 10.56,72.19 10.98,72.19 arc(11,72.18) U5.4
$1N4113: length 49
  Top Layer w0.254: U4.7 2.55,60.12 arc(2.1,60.31) 1.92,60.76 1.92,77.9 arc(2.59,79.52) 4.21,80.19 v1(4.97,80.19)
  Top Layer w0.381: v1(18.56,86.41) 22.49,86.41 arc(23.21,86.71) 23.51,87.43 v1(23.51,88.95) 23.51,88.95 24.09,89.53
  Bottom Layer w0.381: v1(18.56,86.41) 11.44,86.41 arc(7.02,84.53) 4.96,80.19 ; LED1.1 23.51,88.96 v1(23.51,88.95)
$1N4121: length 47.1
  Top Layer w0.254: v1(6.49,79.3) 4.33,79.3 arc(2.98,78.74) 2.43,77.4 2.43,61.65 arc(2.5,61.47) 2.68,61.39 U4.6
  Top Layer w0.381: v1(24.78,86.67) LED4.1
  Bottom Layer w0.381: LED3.1 24.78,87.65 v1(24.78,86.67) 24.78,86.25 arc(24.6,85.83) 24.18,85.65 11.57,85.65 arc(7.75,83.5) v1(6.49,79.3)
$1N5064: length 61.9
  Top Layer w0.254: 9.54,63.55 11.69,63.55 arc(12.32,63.29) 12.58,62.66
  Top Layer w0.381: v1(24.53,91.37) arc(26.07,89.76) 26.43,87.56
  Bottom Layer w0.381: 24.57,91.37 arc(26.12,89.76) 26.48,87.56 ; v1(9.67,63.55) 5.6,63.55 arc(4.17,64.15) 3.57,65.58 3.57,80.34 arc(5.94,86.07) 11.67,88.44 20.33,88.44 arc(21.5,88.93) 21.99,90.1 arc(22.36,90.99) 23.25,91.37 v1(24.53,91.37)
$1N5356: length 2.3
  Top Layer w0.254: 9.15,60.12 10.44,60.12 arc(10.89,60.31) 11.07,60.76
$1N10896: length 31.5
  Top Layer w0.381: v1(14.1,2.47) 14.1,9.06 arc(15,11.22) 17.16,12.12 23.13,12.12 arc(23.85,12.41) 24.14,13.13 24.14,22.4 arc(24.33,22.85) 24.78,23.04 25.55,23.04
  Bottom Layer w0.381: KEY1.2 v1(14.1,2.47)
$1N16714: length 4.2
  Top Layer w0.254: 11.24,26.19 11.24,27.16 12.08,27.99 13.09,27.99 13.79,28.69 C14.2
$1N16794: length 2.6
  Top Layer w0.254: P1.22 10.25,28.38 C16.2
$1N16876: length 2.6
  Top Layer w0.254: P1.24 9.25,27.19 arc(9.12,27.49) 8.83,27.61 8.08,27.61 C18.2
$1N17283: length 4.8
  Top Layer w0.254: C13.2 14.68,27.99 13.73,27.99 13.22,27.48 12.46,27.48 12.25,27.27 P1.18
$1N19263: length 2.6
  Top Layer w0.254: P1.5 18.75,28.5 C11.2
$1N20556: length 18.7
  Top Layer w0.381: 12.08,35.34 D1.2 ; 12.08,35.34 12.08,35.22 ; 12.08,35.34 arc(12.35,35.23) 12.46,34.96 12.46,34.22 arc(12.61,33.86) 12.97,33.71 14.49,33.71 arc(15.18,33.58) 15.76,33.2 16.91,32.06 arc(17.43,31.7) 18.05,31.55 21.99,31.55 ; C7.2 23.64,32.56 arc(23.28,32.71) 23.13,33.07 v1(23.13,33.58)
  Bottom Layer w0.381: v1(22.18,31.55) 22.18,33.01 arc(22.35,33.41) 22.75,33.58 v1(23.13,33.58)
$1N20618: length 17.5
  Top Layer w0.381: 14.95,35.61 16.78,35.61 ; 16.78,35.61 v1(18.81,35.61) ; 16.78,35.61 16.72,35.55 Q1.3 ; 14.95,35.74 14.94,35.72
  Top Layer w0.508: C7.1 25.1,30.46
  Bottom Layer w0.381: v1(25.03,31.8) 25.03,34.85 arc(24.81,35.39) 24.27,35.61 v1(18.81,35.61)
$1N39288: length 20.3
  Top Layer w0.508: CN3.5 16.91,73.33 arc(18.06,70.55) 20.84,69.39 21.73,69.39 arc(22.54,69.06) 22.87,68.25 22.87,67.57 arc(22.85,67.51) U6.16
$1N39568: length 23.1
  Top Layer w0.508: U6.15 24.14,66.22 arc(24.5,66.37) 24.65,66.73 24.65,69.27 arc(24.21,70.34) 23.13,70.79 21.48,70.79 arc(20.04,71.39) 19.45,72.82 CN3.4
$1N39637: length 23.9
  Top Layer w0.508: U6.14 24.4,64.95 arc(25.39,65.36) 25.8,66.35 25.8,71.68 arc(25.38,72.67) 24.39,73.08 23.66,73.08 arc(22.48,73.57) 21.99,74.75 CN3.3
$1N39740: length 24.9
  Top Layer w0.508: 22.8,63.68 24.73,63.68 arc(26.2,64.29) 26.81,65.76 26.81,74.35 arc(26.55,74.98) 25.92,75.24 25.54,75.24 arc(24.82,75.53) 24.53,76.25 CN3.2
$1N63361: length 14.8
  Top Layer w0.254: 11.32,81.59 11.32,82.09 arc(11.17,82.45) 10.81,82.6 10.17,82.6 arc(9.64,82.83) 9.41,83.36 9.41,85.27 arc(9.04,86.17) v1(8.14,86.54)
  Top Layer w0.381: v1(14.49,87.68) 14.49,88.79 U1.B5
  Bottom Layer w0.254: v1(8.14,86.54) arc(9.3,87.37) 10.68,87.68 v1(14.49,87.68)
$1N63365: length 17.8
  Top Layer w0.254: v1(11.32,78.54) R2.1 ; 11.32,83.11 11.32,85.52 arc(10.91,86.51) v1(9.92,86.92)
  Top Layer w0.381: U1.A5 15.51,88.79 v1(15.51,87.68)
  Bottom Layer w0.254: 15.51,87.81 15.51,87.3 arc(15.43,87.12) 15.25,87.05 10.05,87.05 arc(9.96,87.01) v1(9.92,86.92) ; v1(11.32,78.54) v1(11.32,83.11)
$1N63715: length 17.3
  Top Layer w0.254: 2.19,34.1 3.55,34.1 arc(4.01,33.91) 4.21,33.45 4.21,24.18 arc(4.02,23.73) 3.57,23.55 arc(3.21,23.4) 3.06,23.04 3.06,20.33 ; C1.2 4.08,28.37
$1N63722: length 11.8
  Top Layer w0.254: 3.06,30.53 3.06,29.72 arc(3.04,29.66) C3.2 ; 3.06,30.53 3.06,32.44 arc(2.95,32.72) 2.67,32.83 U3.3 ; 3.06,30.53 v1(2.55,30.53)
  Top Layer w0.635: 2.43,25.71 v1(1.42,25.71) 1.41,25.71
  Bottom Layer w0.254: v1(2.55,30.53) 1.92,30.53 arc(1.56,30.38) 1.42,30.03 v1(1.42,25.71)

## Copper pours and planes (outline as drawn; the poured copper is in the pictures)
GND on Top Layer: -1.38,101.91 31.26,101.91 31.26,-0.58 -1.38,-0.58
GND on Bottom Layer: -2.65,102.92 32.53,102.92 32.53,-1.85 -2.65,-1.85
(no net) on Top Layer: 26.82,80.31 27.82,80.31 27.82,79.3 26.82,79.3
(no net) on Top Layer: 3.07,14.27 4.07,14.27 4.07,13.26 3.07,13.26
(no net) on Bottom Layer: 26.82,78.79 27.82,78.79 27.82,77.78 26.82,77.78
(no net) on Bottom Layer: 3.07,14.27 4.07,14.27 4.07,13.26 3.07,13.26

Small or netless copper shapes (teardrops, artwork), in the pictures only: 341 on Top Layer, 135 on Bottom Layer

## Text on the board
Bottom Silkscreen Layer: V | G | ON | OFF | TXD | BOOT | RXD | GREEN | RED | 扫码观看安装视频 | 专利保护 / 商仿必究
Top Silkscreen Layer: ON | OFF | 24 | 1 | GREEN | RED | Sun | Battery | NO.:
